# Altium schematic sheet Sheet1_MB.SchDoc
size A3; SheetNumber: 1; SheetTotal: 1
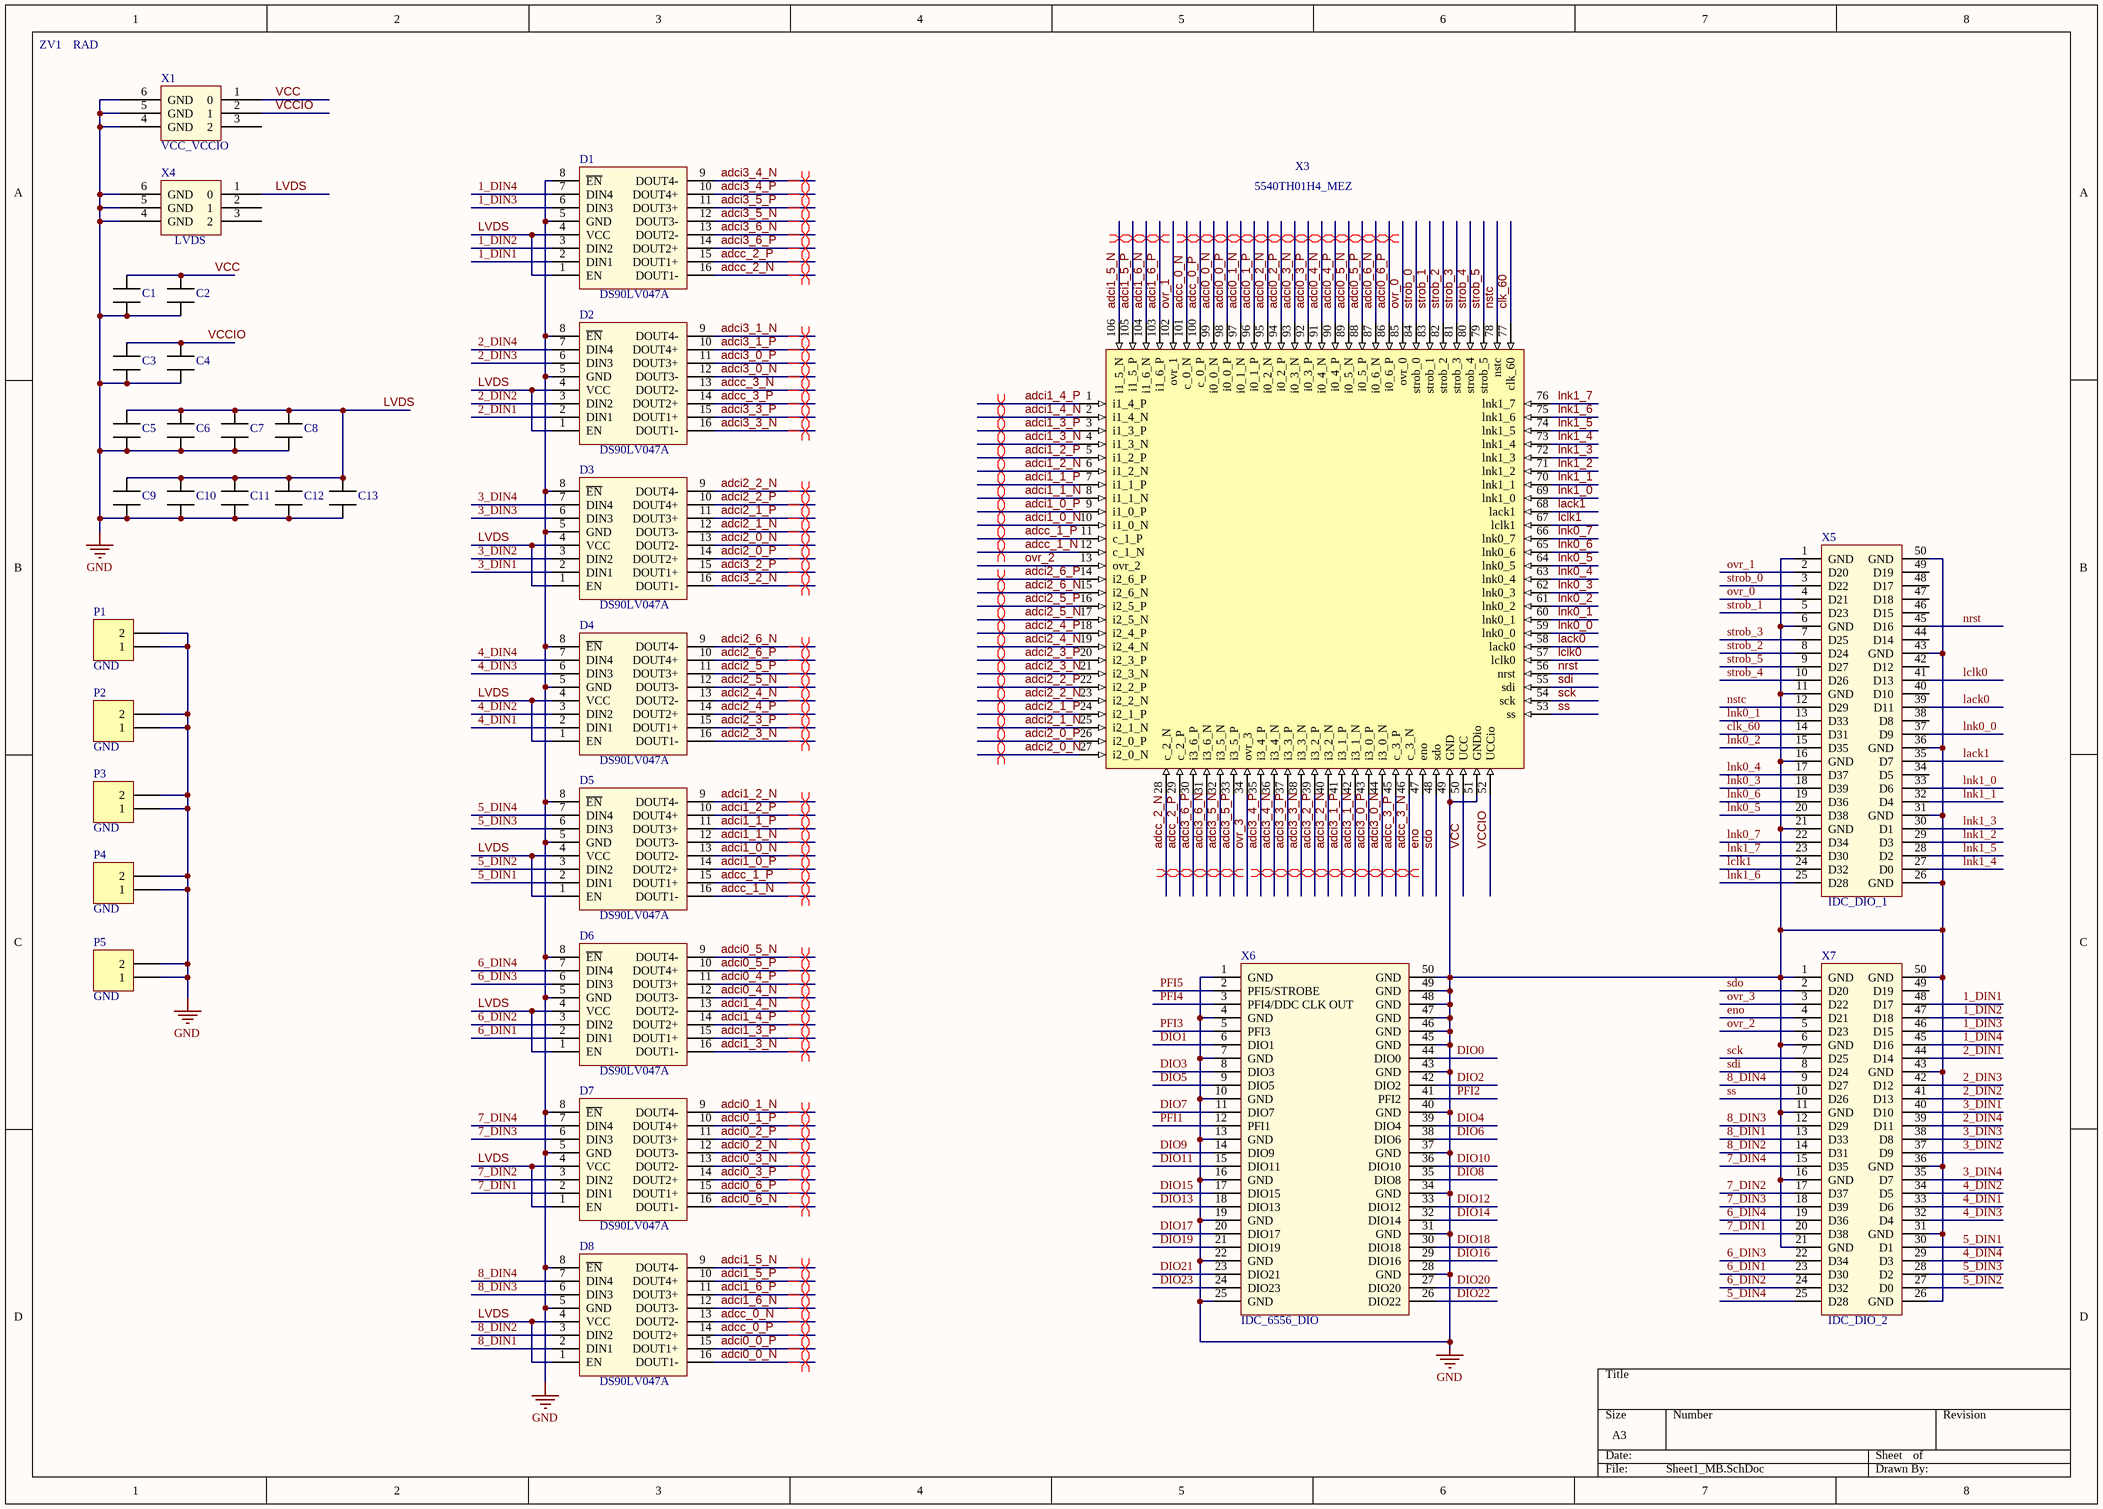
[diagram p0: Sheet1_MB.SchDoc]

## Parts
C1  CAP_BIG  [Cap_BIG]  (value not drawn)
C2  CAP_SMALL  [CAP_SMALL]  (value not drawn)
C3  CAP_BIG  [Cap_BIG]  (value not drawn)
C4  CAP_SMALL  [CAP_SMALL]  (value not drawn)
C5  CAP_BIG  [Cap_BIG]  (value not drawn)
C6  CAP_SMALL  [CAP_SMALL]  (value not drawn)
C7  CAP_SMALL  [CAP_SMALL]  (value not drawn)
C8  CAP_SMALL  [CAP_SMALL]  (value not drawn)
C9  CAP_SMALL  [CAP_SMALL]  (value not drawn)
C10  CAP_SMALL  [CAP_SMALL]  (value not drawn)
C11  CAP_SMALL  [CAP_SMALL]  (value not drawn)
C12  CAP_SMALL  [CAP_SMALL]  (value not drawn)
C13  CAP_SMALL  [CAP_SMALL]  (value not drawn)
D1  DS90LV047A  [TSOP65P640X120-16N]
D2  DS90LV047A  [TSOP65P640X120-16N]
D3  DS90LV047A  [TSOP65P640X120-16N]
D4  DS90LV047A  [TSOP65P640X120-16N]
D5  DS90LV047A  [TSOP65P640X120-16N]
D6  DS90LV047A  [TSOP65P640X120-16N]
D7  DS90LV047A  [TSOP65P640X120-16N]
D8  DS90LV047A  [TSOP65P640X120-16N]
P1  GND  [HDR1X2]
P2  GND  [HDR1X2]
P3  GND  [HDR1X2]
P4  GND  [HDR1X2]
P5  GND  [HDR1X2]
X1  VCC_VCCIO  [POWER]
X3  5540TH01H4_MEZ  [5540TH01H4_MEZ]
X4  LVDS  [POWER]
X5  IDC_DIO_1  [IDC_DIO]
X6  IDC_6556_DIO  [IDC_6556_DIO]
X7  IDC_DIO_2  [IDC_DIO]
ZV1  RAD  [RADIATION]

## Nets
GND: C1.1 C2.1 C3.1 C4.1 C5.1 C6.1 C7.1 C8.1 C9.1 C10.1 C11.1 C12.1 C13.1 D1.5(GND) D1.8(~{EN}) D2.5(GND) D2.8(~{EN}) D3.5(GND) D3.8(~{EN}) D4.5(GND) D4.8(~{EN}) D5.5(GND) D5.8(~{EN}) D6.5(GND) D6.8(~{EN}) D7.5(GND) D7.8(~{EN}) D8.5(GND) D8.8(~{EN}) P1.1 P1.2 P2.1 P2.2 P3.1 P3.2 P4.1 P4.2 P5.1 P5.2 X1.4(GND) X1.5(GND) X1.6(GND) X3.49(GND) X3.51(GNDio) X4.4(GND) X4.5(GND) X4.6(GND) X5.1(GND) X5.6(GND) X5.11(GND) X5.16(GND) X5.21(GND) X5.26(GND) X5.31(GND) X5.36(GND) X5.43(GND) X5.50(GND) X6.1(GND) X6.4(GND) X6.7(GND) X6.10(GND) X6.13(GND) X6.16(GND) X6.19(GND) X6.22(GND) X6.25(GND) X6.28(GND) X6.31(GND) X6.34(GND) X6.37(GND) X6.40(GND) X6.43(GND) X6.45(GND) X6.46(GND) X6.47(GND) X6.48(GND) X6.49(GND) X6.50(GND) X7.1(GND) X7.6(GND) X7.11(GND) X7.16(GND) X7.21(GND) X7.26(GND) X7.31(GND) X7.36(GND) X7.43(GND) X7.50(GND)
1_DIN1: D1.2(DIN1) X7.48(D17)
1_DIN2: D1.3(DIN2) X7.47(D18)
1_DIN3: D1.6(DIN3) X7.46(D15)
1_DIN4: D1.7(DIN4) X7.45(D16)
2_DIN1: D2.2(DIN1) X7.44(D14)
2_DIN2: D2.3(DIN2) X7.41(D13)
2_DIN3: D2.6(DIN3) X7.42(D12)
2_DIN4: D2.7(DIN4) X7.39(D11)
3_DIN1: D3.2(DIN1) X7.40(D10)
3_DIN2: D3.3(DIN2) X7.37(D9)
3_DIN3: D3.6(DIN3) X7.38(D8)
3_DIN4: D3.7(DIN4) X7.35(D7)
4_DIN1: D4.2(DIN1) X7.33(D6)
4_DIN2: D4.3(DIN2) X7.34(D5)
4_DIN3: D4.6(DIN3) X7.32(D4)
4_DIN4: D4.7(DIN4) X7.29(D3)
5_DIN1: D5.2(DIN1) X7.30(D1)
5_DIN2: D5.3(DIN2) X7.27(D0)
5_DIN3: D5.6(DIN3) X7.28(D2)
5_DIN4: D5.7(DIN4) X7.25(D28)
6_DIN1: D6.2(DIN1) X7.23(D30)
6_DIN2: D6.3(DIN2) X7.24(D32)
6_DIN3: D6.6(DIN3) X7.22(D34)
6_DIN4: D6.7(DIN4) X7.19(D36)
7_DIN1: D7.2(DIN1) X7.20(D38)
7_DIN2: D7.3(DIN2) X7.17(D37)
7_DIN3: D7.6(DIN3) X7.18(D39)
7_DIN4: D7.7(DIN4) X7.15(D35)
8_DIN1: D8.2(DIN1) X7.13(D33)
8_DIN2: D8.3(DIN2) X7.14(D31)
8_DIN3: D8.6(DIN3) X7.12(D29)
8_DIN4: D8.7(DIN4) X7.9(D27)
adcc_0_N: D8.13(DOUT2-) X3.101(c_0_N)
adcc_0_P: D8.14(DOUT2+) X3.100(c_0_P)
adcc_1_N: D5.16(DOUT1-) X3.12(c_1_N)
adcc_1_P: D5.15(DOUT1+) X3.11(c_1_P)
adcc_2_N: D1.16(DOUT1-) X3.28(c_2_N)
adcc_2_P: D1.15(DOUT1+) X3.29(c_2_P)
adcc_3_N: D2.13(DOUT2-) X3.46(c_3_N)
adcc_3_P: D2.14(DOUT2+) X3.45(c_3_P)
adci0_0_N: D8.16(DOUT1-) X3.99(i0_0_N)
adci0_0_P: D8.15(DOUT1+) X3.98(i0_0_P)
adci0_1_N: D7.9(DOUT4-) X3.97(i0_1_N)
adci0_1_P: D7.10(DOUT4+) X3.96(i0_1_P)
adci0_2_N: D7.12(DOUT3-) X3.95(i0_2_N)
adci0_2_P: D7.11(DOUT3+) X3.94(i0_2_P)
adci0_3_N: D7.13(DOUT2-) X3.93(i0_3_N)
adci0_3_P: D7.14(DOUT2+) X3.92(i0_3_P)
adci0_4_N: D6.12(DOUT3-) X3.91(i0_4_N)
adci0_4_P: D6.11(DOUT3+) X3.90(i0_4_P)
adci0_5_N: D6.9(DOUT4-) X3.89(i0_5_N)
adci0_5_P: D6.10(DOUT4+) X3.88(i0_5_P)
adci0_6_N: D7.16(DOUT1-) X3.87(i0_6_N)
adci0_6_P: D7.15(DOUT1+) X3.86(i0_6_P)
adci1_0_N: D5.13(DOUT2-) X3.10(i1_0_N)
adci1_0_P: D5.14(DOUT2+) X3.9(i1_0_P)
adci1_1_N: D5.12(DOUT3-) X3.8(i1_1_N)
adci1_1_P: D5.11(DOUT3+) X3.7(i1_1_P)
adci1_2_N: D5.9(DOUT4-) X3.6(i1_2_N)
adci1_2_P: D5.10(DOUT4+) X3.5(i1_2_P)
adci1_3_N: D6.16(DOUT1-) X3.4(i1_3_N)
adci1_3_P: D6.15(DOUT1+) X3.3(i1_3_P)
adci1_4_N: D6.13(DOUT2-) X3.2(i1_4_N)
adci1_4_P: D6.14(DOUT2+) X3.1(i1_4_P)
adci1_5_N: D8.9(DOUT4-) X3.106(i1_5_N)
adci1_5_P: D8.10(DOUT4+) X3.105(i1_5_P)
adci1_6_N: D8.12(DOUT3-) X3.104(i1_6_N)
adci1_6_P: D8.11(DOUT3+) X3.103(i1_6_P)
adci2_0_N: D3.13(DOUT2-) X3.27(i2_0_N)
adci2_0_P: D3.14(DOUT2+) X3.26(i2_0_P)
adci2_1_N: D3.12(DOUT3-) X3.25(i2_1_N)
adci2_1_P: D3.11(DOUT3+) X3.24(i2_1_P)
adci2_2_N: D3.9(DOUT4-) X3.23(i2_2_N)
adci2_2_P: D3.10(DOUT4+) X3.22(i2_2_P)
adci2_3_N: D4.16(DOUT1-) X3.21(i2_3_N)
adci2_3_P: D4.15(DOUT1+) X3.20(i2_3_P)
adci2_4_N: D4.13(DOUT2-) X3.19(i2_4_N)
adci2_4_P: D4.14(DOUT2+) X3.18(i2_4_P)
adci2_5_N: D4.12(DOUT3-) X3.17(i2_5_N)
adci2_5_P: D4.11(DOUT3+) X3.16(i2_5_P)
adci2_6_N: D4.9(DOUT4-) X3.15(i2_6_N)
adci2_6_P: D4.10(DOUT4+) X3.14(i2_6_P)
adci3_0_N: D2.12(DOUT3-) X3.44(i3_0_N)
adci3_0_P: D2.11(DOUT3+) X3.43(i3_0_P)
adci3_1_N: D2.9(DOUT4-) X3.42(i3_1_N)
adci3_1_P: D2.10(DOUT4+) X3.41(i3_1_P)
adci3_2_N: D3.16(DOUT1-) X3.40(i3_2_N)
adci3_2_P: D3.15(DOUT1+) X3.39(i3_2_P)
adci3_3_N: D2.16(DOUT1-) X3.38(i3_3_N)
adci3_3_P: D2.15(DOUT1+) X3.37(i3_3_P)
adci3_4_N: D1.9(DOUT4-) X3.36(i3_4_N)
adci3_4_P: D1.10(DOUT4+) X3.35(i3_4_P)
adci3_5_N: D1.12(DOUT3-) X3.32(i3_5_N)
adci3_5_P: D1.11(DOUT3+) X3.33(i3_5_P)
adci3_6_N: D1.13(DOUT2-) X3.31(i3_6_N)
adci3_6_P: D1.14(DOUT2+) X3.30(i3_6_P)
clk_60: X3.77(clk_60) X5.14(D31)
DIO0: X6.44(DIO0)
DIO1: X6.6(DIO1)
DIO2: X6.42(DIO2)
DIO3: X6.8(DIO3)
DIO4: X6.39(DIO4)
DIO5: X6.9(DIO5)
DIO6: X6.38(DIO6)
DIO7: X6.11(DIO7)
DIO8: X6.35(DIO8)
DIO9: X6.14(DIO9)
DIO10: X6.36(DIO10)
DIO11: X6.15(DIO11)
DIO12: X6.33(DIO12)
DIO13: X6.18(DIO13)
DIO14: X6.32(DIO14)
DIO15: X6.17(DIO15)
DIO16: X6.29(DIO16)
DIO17: X6.20(DIO17)
DIO18: X6.30(DIO18)
DIO19: X6.21(DIO19)
DIO20: X6.27(DIO20)
DIO21: X6.23(DIO21)
DIO22: X6.26(DIO22)
DIO23: X6.24(DIO23)
eno: X3.47(eno) X7.4(D21)
lack0: X3.58(lack0) X5.39(D11)
lack1: X3.68(lack1) X5.35(D7)
lclk0: X3.57(lclk0) X5.41(D13)
lclk1: X3.67(lclk1) X5.24(D32)
lnk0_0: X3.59(lnk0_0) X5.37(D9)
lnk0_1: X3.60(lnk0_1) X5.13(D33)
lnk0_2: X3.61(lnk0_2) X5.15(D35)
lnk0_3: X3.62(lnk0_3) X5.18(D39)
lnk0_4: X3.63(lnk0_4) X5.17(D37)
lnk0_5: X3.64(lnk0_5) X5.20(D38)
lnk0_6: X3.65(lnk0_6) X5.19(D36)
lnk0_7: X3.66(lnk0_7) X5.22(D34)
lnk1_0: X3.69(lnk1_0) X5.33(D6)
lnk1_1: X3.70(lnk1_1) X5.32(D4)
lnk1_2: X3.71(lnk1_2) X5.29(D3)
lnk1_3: X3.72(lnk1_3) X5.30(D1)
lnk1_4: X3.73(lnk1_4) X5.27(D0)
lnk1_5: X3.74(lnk1_5) X5.28(D2)
lnk1_6: X3.75(lnk1_6) X5.25(D28)
lnk1_7: X3.76(lnk1_7) X5.23(D30)
LVDS: C5.2 C6.2 C7.2 C8.2 C9.2 C10.2 C11.2 C12.2 C13.2 D1.1(EN) D1.4(VCC) D2.1(EN) D2.4(VCC) D3.1(EN) D3.4(VCC) D4.1(EN) D4.4(VCC) D5.1(EN) D5.4(VCC) D6.1(EN) D6.4(VCC) D7.1(EN) D7.4(VCC) D8.1(EN) D8.4(VCC) X4.1(0)
nrst: X3.56(nrst) X5.45(D16)
nstc: X3.78(nstc) X5.12(D29)
ovr_0: X3.85(ovr_0) X5.4(D21)
ovr_1: X3.102(ovr_1) X5.2(D20)
ovr_2: X3.13(ovr_2) X7.5(D23)
ovr_3: X3.34(ovr_3) X7.3(D22)
PFI1: X6.12(PFI1)
PFI2: X6.41(PFI2)
PFI3: X6.5(PFI3)
PFI4: X6.3(PFI4/DDC_CLK_OUT)
PFI5: X6.2(PFI5/STROBE)
sck: X3.54(sck) X7.7(D25)
sdi: X3.55(sdi) X7.8(D24)
sdo: X3.48(sdo) X7.2(D20)
ss: X3.53(ss) X7.10(D26)
strob_0: X3.84(strob_0) X5.3(D22)
strob_1: X3.83(strob_1) X5.5(D23)
strob_2: X3.82(strob_2) X5.8(D24)
strob_3: X3.81(strob_3) X5.7(D25)
strob_4: X3.80(strob_4) X5.10(D26)
strob_5: X3.79(strob_5) X5.9(D27)
VCC: C1.2 C2.2 X1.1(0) X3.50(UCC)
VCCIO: C3.2 C4.2 X1.2(1) X3.52(UCCio)

Not connected (* = marked no-connect by the designer): X1 3(2); X4 2(1) 3(2); X5 34(D5) 38(D8) 40(D10) 42(D12) 44(D14) 46(D15) 47(D18) 48(D17) 49(D19); X7 49(D19)

## Layout directives
differential pair: adcc_0_N, adcc_0_P, adcc_1_N, adcc_1_P, adcc_2_N, adcc_2_P, adcc_3_N, adcc_3_P, adci0_0_N, adci0_0_P, adci0_1_N, adci0_1_P, adci0_2_N, adci0_2_P, adci0_3_N, adci0_3_P, adci0_4_N, adci0_4_P, adci0_5_N, adci0_5_P, adci0_6_N, adci0_6_P, adci1_0_N, adci1_0_P, adci1_1_N, adci1_1_P, adci1_2_N, adci1_2_P, adci1_3_N, adci1_3_P, adci1_4_N, adci1_4_P, adci1_5_N, adci1_5_P, adci1_6_N, adci1_6_P, adci2_0_N, adci2_0_P, adci2_1_N, adci2_1_P, adci2_2_N, adci2_2_P, adci2_3_N, adci2_3_P, adci2_4_N, adci2_4_P, adci2_5_N, adci2_5_P, adci2_6_N, adci2_6_P, adci3_0_N, adci3_0_P, adci3_1_N, adci3_1_P, adci3_2_N, adci3_2_P, adci3_3_N, adci3_3_P, adci3_4_N, adci3_4_P, adci3_5_N, adci3_5_P, adci3_6_N, adci3_6_P

## Library data of the parts
P1-P5 = Header 2: Header, 2-Pin; LatestRevisionDate: 17-Jul-2002; LatestRevisionNote: Re-released for DXP Platform.; Publisher: Altium Limited
X1 X4 = POWER
X5 X7 = IDC_DIO
ZV1 = Radiation